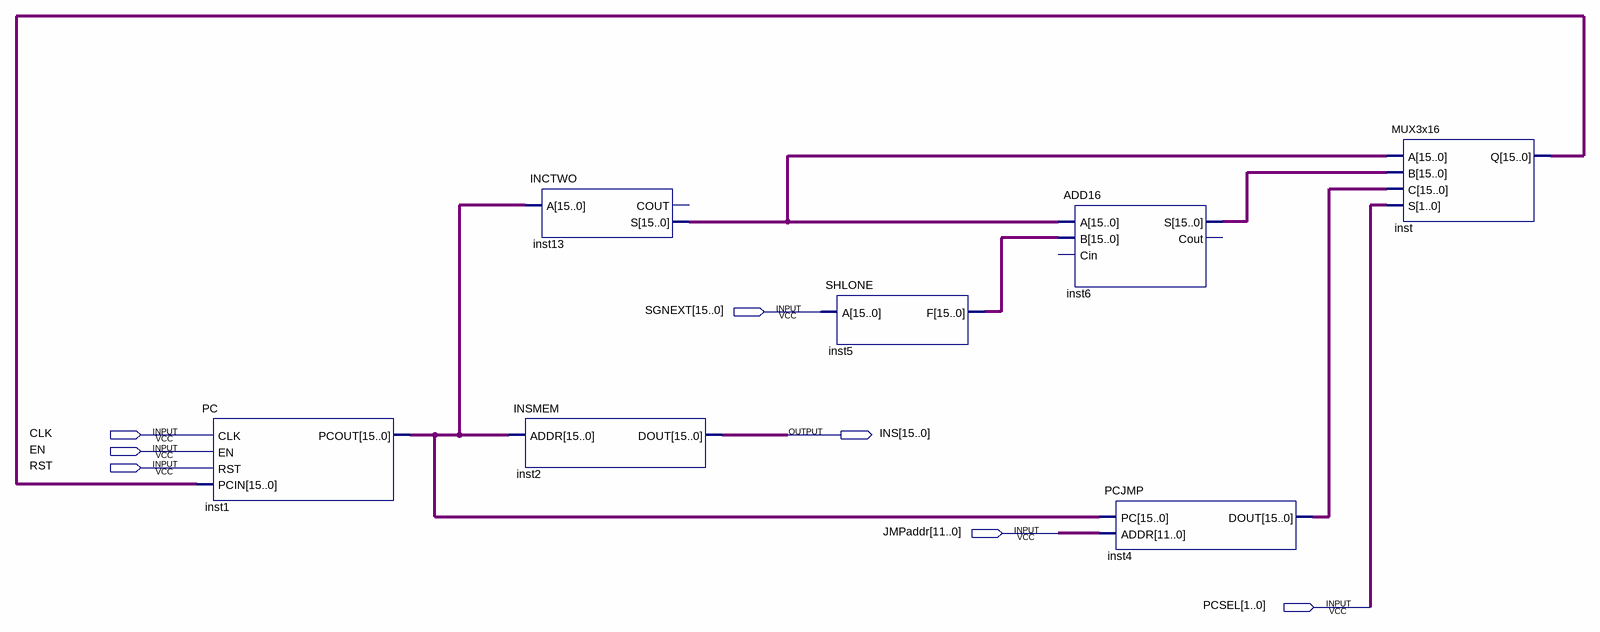
[diagram p0: schematic sheet]
// Quartus schematic PCloop.bdf as structural Verilog: 7 symbols, 7 pins
module PCloop (
  input  [15:0] SGNEXT,
  input  CLK,
  input  EN,
  input  RST,
  input  [11:0] JMPaddr,
  input  [1:0] PCSEL,
  output [15:0] INS
);

  wire [15:0] inst1_pcout, inst4_dout, inst5_f, inst6_s, inst13_s, inst_q;

  PC inst1 (.CLK(CLK), .EN(EN), .RST(RST), .PCIN(inst_q), .PCOUT(inst1_pcout));
  INCTWO inst13 (.A(inst1_pcout), .S(inst13_s));  // open: COUT
  INSMEM inst2 (.ADDR(inst1_pcout), .DOUT(INS));
  SHLONE inst5 (.A(SGNEXT), .F(inst5_f));
  ADD16 inst6 (.A(inst13_s), .B(inst5_f), .S(inst6_s));  // open: Cin, Cout
  PCJMP inst4 (.PC(inst1_pcout), .ADDR(JMPaddr), .DOUT(inst4_dout));
  MUX3x16 inst (.A(inst13_s), .B(inst6_s), .C(inst4_dout), .S(PCSEL), .Q(inst_q));
endmodule
